# Altium schematic sheet Subtractor.SchDoc
size A; SheetNumber: 2; SheetTotal: 6
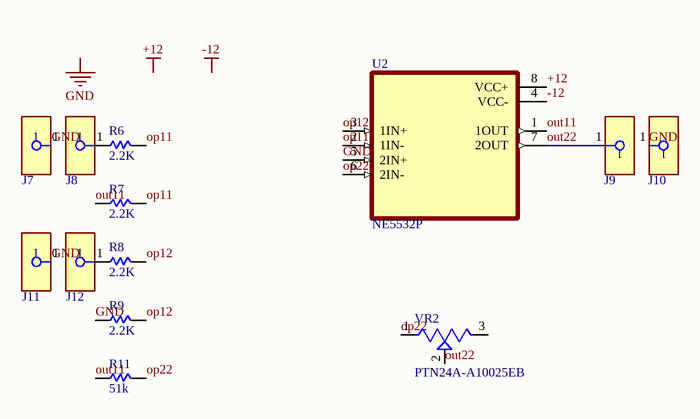
[diagram p0: Subtractor.SchDoc]

## Parts
J7  1581-5  [FP-1581-5-MFG]  (value not drawn)
J8  1581-5  [FP-1581-5-MFG]  (value not drawn)
J9  1581-5  [FP-1581-5-MFG]  (value not drawn)
J10  1581-5  [FP-1581-5-MFG]  (value not drawn)
J11  1581-5  [FP-1581-5-MFG]  (value not drawn)
J12  1581-5  [FP-1581-5-MFG]  (value not drawn)
R6  value 2.2K  [RESAD1100W55L680D260]  (hidden comment: MFR-25FBF52-1K)
R7  value 2.2K  [RESAD1100W55L680D260]  (hidden comment: MFR-25FBF52-1K)
R8  value 2.2K  [RESAD1100W55L680D260]  (hidden comment: MFR-25FBF52-1K)
R9  value 2.2K  [RESAD1100W55L680D260]  (hidden comment: MFR-25FBF52-1K)
R11  value 51k  [RESAD1100W55L680D260]  (hidden comment: MFR-25FBF52-1K)
U2  NE5532P  [DIP794W45P254L959H508Q8]
VR2  PTN24A-A10025EB  [TRIM_PTN24A-A10025EB]

## Nets
+12: U2.8(VCC+)
-12: U2.4(VCC-)
GND: J7.1 J10.1 J11.1 R9.1 U2.5(2IN+)
op11: R6.2 R7.2 U2.2(1IN-)
op12: R8.2 R9.2 U2.3(1IN+)
op22: R11.2 U2.6(2IN-) VR2.1
out11: R7.1 R11.1 U2.1(1OUT)
out22: J9.1 U2.7(2OUT) VR2.2
NetJ8_1: J8.1 R6.1
NetJ12_1: J12.1 R8.1

Not connected (* = marked no-connect by the designer): VR2 3

## Notes on the sheet
- Labels drawn without touching a wire or pin: +12, -12, GND

## Library data of the parts
J7-J12 = CMP-73906-000011-1: CONN BANANA JACK TURRET GREEN; Body Material: PC; Number of Contacts: 1; Max Current Rating: 15A; Voltage Rating (AC): 30V; Insulation: Mating End Insulated; Voltage Rating: 2.5kV; Voltage Rating (DC): 60V; Gender: Female; Height: 0.25inch; Mount: Panel; RoHS Compliant: Yes; Length: 1.22inch; Orientation: Straight; Diameter: 4.22mm; Lead Free: Lead Free; Package Quantity: 1; Termination: Turret; Current Rating: 15A; Packaging: Bag; Series: 1581; REACH SVHC: No SVHC; Number of Positions: 1; Contact Plating: Tin; Housing Color: Green; Contact Material: Brass; Insulation Material: Polycarbonate; Weight: 0.126lb; Number of Ports: 1; Color: Green; Housing Material: Polycarbonate; Width: 4inch
R6-R9 R11 = MFR-25FBF52-1K: 1.07 kOhms Â±1% 0.25W, 1/4W Through Hole Resistor Axial - Metal Film; MF: Yageo; SnapEDA_Link: https://www.snapeda.com/parts/MFR-25FBF52-1K/Yageo/view-part/?ref=snap; Package: RADIAL-2 YAGEO; MP: MFR-25FBF52-1K; Check_prices: https://www.snapeda.com/parts/MFR-25FBF52-1K/Yageo/view-part/?ref=eda
U2 = NE5532P: Dual, 30-V, 10-MHz, low-noise operational amplifier for audio applications; MF: Texas Instruments; SnapEDA_Link: https://www.snapeda.com/parts/NE5532P/Texas+Instruments/view-part/?ref=snap; Package: PDIP-8 Texas; Value: *; MP: NE5532P; Check_prices: https://www.snapeda.com/parts/NE5532P/Texas+Instruments/view-part/?ref=eda
VR2 = PTN24A-A10025EB: 100k Ohm 1 Gang Linear Panel Mount Potentiometer 1.0 Turns Carbon 0.5W, 1/2W PC Pins; MF: Same Sky; SnapEDA_Link: https://www.snapeda.com/parts/PTN24A-A10025EB/Same+Sky/view-part/?ref=snap; Package: Package; Value: *; MP: PTN24A-A10025EB; Check_prices: https://www.snapeda.com/parts/PTN24A-A10025EB/Same+Sky/view-part/?ref=eda